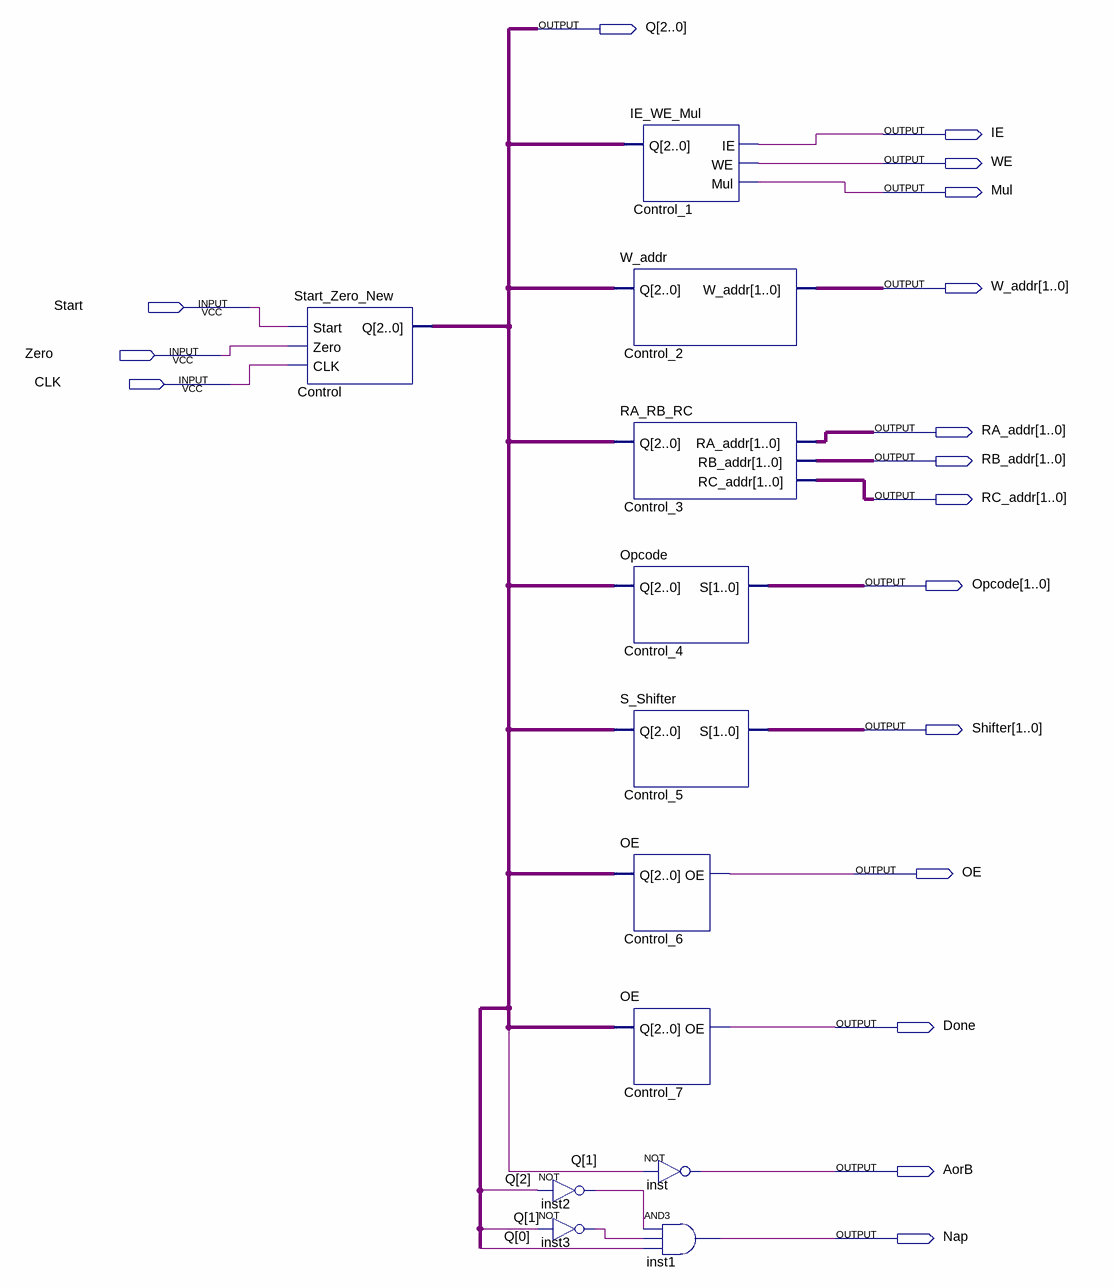
[diagram p0: schematic sheet]
// Quartus schematic Control.bdf as structural Verilog: 12 symbols, 17 pins
module Control (
  input  Start,
  input  Zero,
  input  CLK,
  output [2:0] Q,
  output IE,
  output WE,
  output Mul,
  output [1:0] W_addr,
  output [1:0] RA_addr,
  output [1:0] RB_addr,
  output [1:0] RC_addr,
  output [1:0] Opcode,
  output [1:0] Shifter,
  output OE,
  output Done,
  output AorB,
  output Nap
);

  wire inst2_out, inst3_out;

  Start_Zero_New Control (.Start(Start), .Zero(Zero), .CLK(CLK), .Q(Q));
  not inst2 (inst2_out, Q[2]);
  not inst3 (inst3_out, Q[1]);
  IE_WE_Mul Control_1 (.Q(Q), .IE(IE), .WE(WE), .Mul(Mul));
  W_addr Control_2 (.Q(Q), .W_addr(W_addr));
  RA_RB_RC Control_3 (.Q(Q), .RA_addr(RA_addr), .RB_addr(RB_addr), .RC_addr(RC_addr));
  Opcode Control_4 (.Q(Q), .S(Opcode));
  S_Shifter Control_5 (.Q(Q), .S(Shifter));
  OE Control_6 (.Q(Q), .OE(OE));
  OE Control_7 (.Q(Q), .OE(Done));
  not inst (AorB, Q[1]);
  and inst1 (Nap, inst2_out, inst3_out, Q[0]);
endmodule
